# Altium project USBtoUARTbreakout.PrjPcb
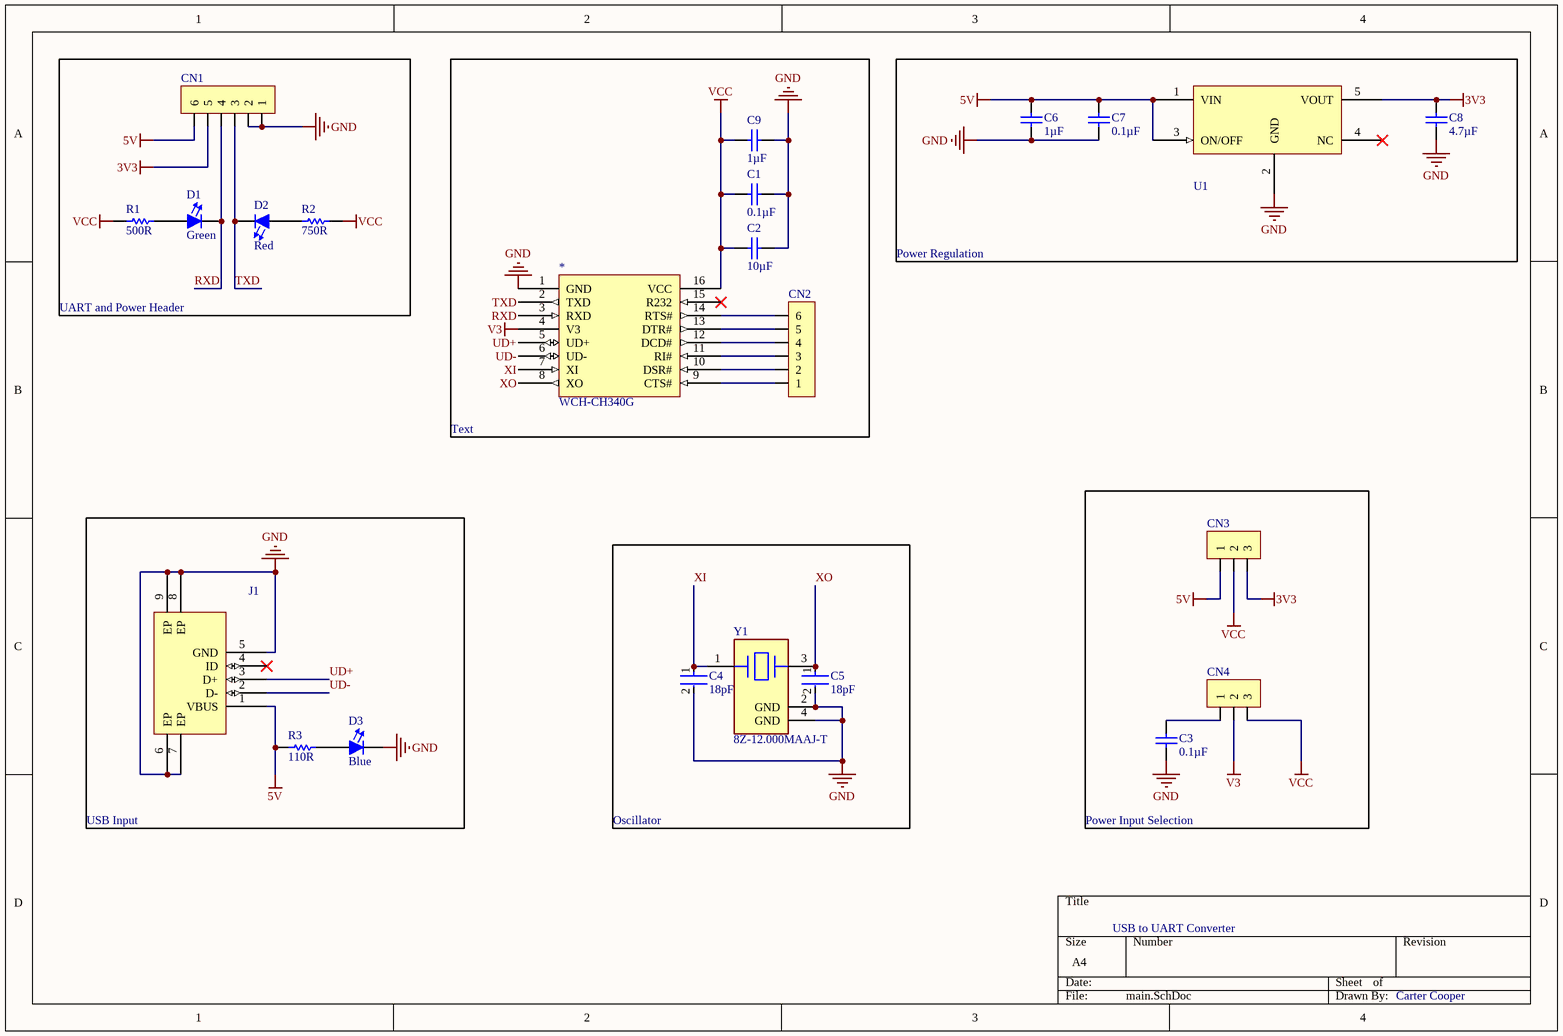
[diagram p0: main.SchDoc]
1 sheet, 23 parts. Net scope: global (net labels, ports and power ports of the same name join across sheets).
Board file: USBtoUARTboard.PcbDoc

## Sheet main.SchDoc
size A4

### Parts
*  WCH-CH340G  [SOP127P600X175-16N]
C1  value 0.1µF  [CAPC1608N(0603")]  (hidden comment: 0.1uF 16V 0603 SMD, Ceramic)
C2  value 10µF  [CAPC1608N(0603")]  (hidden comment: 0.1uF 16V 0603 SMD, Ceramic)
C3  value 0.1µF  [CAPC1608N(0603")]  (hidden comment: 0.1uF 16V 0603 SMD, Ceramic)
C4  Capacitance: 18pF  [FP-CGA3E-0_3-0_1-MFG]  (hidden comment: CGA3E2C0G1H180J080AA)
C5  Capacitance: 18pF  [FP-CGA3E-0_3-0_1-MFG]  (hidden comment: CGA3E2C0G1H180J080AA)
C6  value 1µF  [CAPC1608N(0603")]  (hidden comment: 1uF 50V 0603 SMD, Ceramic)
C7  value 0.1µF  [CAPC1608N(0603")]  (hidden comment: 0.1uF 16V 0603 SMD, Ceramic)
C8  value 4.7µF  [CAPC1608N(0603")]  (hidden comment: 4.7uF 10V 0603 SMD, Ceramic)
C9  value 1µF  [CAPC1608N(0603")]  (hidden comment: 1uF 50V 0603 SMD, Ceramic)
CN1  Header, Male, 1x6  [Header, Male, 1X6]  (value not drawn)
CN2  Header, Male, 1x6  [Header, Male, 1X6]  (value not drawn)
CN3  Header, Male, 1x3, Pitch: 0.1" (2.54mm), THT  [Header, Male, 1x3, Pitch: 0.1" (2.54mm),THT]  (value not drawn)
CN4  Header, Male, 1x3, Pitch: 0.1" (2.54mm), THT  [Header, Male, 1x3, Pitch: 0.1" (2.54mm),THT]  (value not drawn)
D1  Color: Green  [FP-LB_Q39E-MFG]  (hidden comment: LT Q39G-Q1OO-25-1)
D2  Color: Red  [FP-LB_Q39E-MFG]  (hidden comment: LSQ976-NR-1)
D3  Color: Blue  [FP-LB_Q39E-MFG]  (hidden comment: LBQ39E-N1OO-35-1)
J1  USB - Micro B Female SMD  [Edge Connector]  (value not drawn)
R1  Resistance: 500R  [RESC0603(1608)_N]  (hidden comment: RC0603FR-07750RL)
R2  Resistance: 750R  [RESC0603(1608)_N]  (hidden comment: RC0603FR-07750RL)
R3  Resistance: 110R  [RESC1608X55X25ML10T15]  (hidden comment: RC0603FR-07110RL)
U1  LP2981-33DBVR  [SOT95P280X145-5N]  (value not drawn)
Y1  8Z-12.000MAAJ-T  [FP-8Z-MFG]

### Blocks framed on the sheet
UART and Power Header: CN1 D1 D2 R1 R2
Text: * C1 C2 C9 CN2
Power Regulation: C6-C8 U1
USB Input: D3 J1 R3
Power Input Selection: C3 CN3 CN4
Oscillator: C4 C5 Y1

### Nets
3V3: C8.2(Cathode) CN1.5 CN3.3 U1.5(VOUT)
5V: C6.2(Cathode) C7.2(Cathode) CN1.6 CN3.1 J1.1(VBUS) R3.2 U1.1(VIN) U1.3(ON/OFF)
GND: *.1(GND) C1.2(Cathode) C2.2(Cathode) C3.1(Anode) C4.2 C5.2 C6.1(Anode) C7.1(Anode) C8.1(Anode) C9.2(Cathode) CN1.1 CN1.2 D3.1(Cathode) J1.5(GND) J1.6(EP) J1.7(EP) J1.8(EP) J1.9(EP) U1.2(GND) Y1.2(GND) Y1.4(GND)
V3: *.4(V3) CN4.2
VCC: *.16(VCC) C1.1(Anode) C2.1(Anode) C9.1(Anode) CN3.2 CN4.3 R1.1 R2.2
RXD: *.3(RXD) CN1.4 D1.1(Cathode)
TXD: *.2(TXD) CN1.3 D2.1(Cathode)
UD+: *.5(UD+) J1.3(D+)
UD-: *.6(UD-) J1.2(D-)
XI: *.7(XI) C4.1 Y1.1
XO: *.8(XO) C5.1 Y1.3
Net*_9: *.9(CTS#) CN2.1
Net*_10: *.10(DSR#) CN2.2
Net*_11: *.11(RI#) CN2.3
Net*_12: *.12(DCD#) CN2.4
Net*_13: *.13(DTR#) CN2.5
Net*_14: *.14(RTS#) CN2.6
NetC3_2: C3.2(Cathode) CN4.1
NetD1_2: D1.2(Anode) R1.2
NetD2_2: D2.2(Anode) R2.1
NetD3_2: D3.2(Anode) R3.1

Not connected (* = marked no-connect by the designer): * 15(R232)*; J1 4(ID)*; U1 4(NC)*

### Notes on the sheet
- USB to UART Converter
- Carter Cooper

### Library data of the parts
* = CMP-031-0001-1: USB to UART Transceiver. USB 2.0 2Mbps. LCSC #C14267; LCSC Part Number: C14267
C1-C3 C7 = CMP-006-0005-1: Capacitor, Ceramic, 16V, +/- 10%, 0603 SMD, X7R; Created By: Andy Bates; Published: 16-04-26; PackageDescription: Chip Capacitor; Pin Count: 2; Source: AUVic_Schematic_Library_Capacitors.SchLib; Design Item ID: 0.1uF 16V 0603 SMD, Ceramic; Component Type: Standard; Publisher: AUVic
C4 C5 = CMP-00115-1: CAP CER 18PF 50V C0G 0603; DK #: 445-5631-1-ND; Tolerance: 5%; Weight: 7.1E-05oz; Lead Free: Lead Free; Depth: 0.8mm; Width: 0.031inch; Mount: Surface Mount; Voltage Rating (DC): 50V; REACH SVHC: No SVHC; Height: 0.8mm; Case/Package: 0603; Resistor Type: Ceramic; Radiation Hardening: No; Case Code (Imperial): 0603; Thickness: 0.035inch; Max Operating Temperature: 125°C; Dielectric: C0G; Min Operating Temperature: -55°C; Voltage Rating: 50V; Packaging: Tape and Reel; Length: 1.6mm; Termination: SMD/SMT; Case Code (Metric): 1608; Package Quantity: 1; Ratings: AEC-Q200
C6 C9 = CMP-006-0028-1: Capacitor, Ceramic, 50V, +/- 10%, 0603 SMD, X5R; Design Item ID: 1uF 50V 0603 SMD, Ceramic; Created By: Lyden Smith; PackageDescription: Chip Capacitor; Source: AUVic_Schematic_Library_Capacitors.SchLib; Date Created: 2017-10-26; Pin Count: 2; Component Type: Standard
C8 = CMP-006-0043-1: Capacitor, Ceramic, 10V, +/- 10%, 0603 SMD, X5R; MFG: Samsung; MFG#: GRM188R61A475KE15D; PackageDescription: Chip Capacitor; Source: AUVic_Schematic_Library_Capacitors.SchLib; Published: 16-06-23; Created By: Ashwin Sira; Component Type: Standard; Pin Count: 2; Publisher: AUVic; Design Item ID: 4.7uF 10V 0603 SMD, Ceramic
CN1 CN2 = CMP-005-0031-1: 1x6, Pads Pitch: 0.1" (2.54mm), Through hole; Made Bates: Andy Bates; Pin Count: 6; Component Type: Standard; Design Item ID: Header, Male, 1x6; Source: AUVic_Schematic_Library_Connectors.SchLib; Supplier 1 Part Number: 952-2270-ND
CN3 CN4 = CMP-005-0025-1: Created By: Ashwin Sira; Pin Count: 3; Component Type: Standard; Design Item ID: Header, Male, 1x3, Pitch: 0.1" (2.54mm), THT; Reviewed By: *; Last Updated: *; Source: AUVic_Schematic_Library_Connectors.SchLib; Publisher: AUVic; Date Published: 2016-03-03
D1 = CMP-00064-3: LED GREEN DIFFUSED 0603 SMD; Dominant Wavelength: 530nm; Luminous Intensity: 280mcd; Lens Style: Diffused,Colorless,Rectangular; Number of LEDs: 1; Forward Voltage: 2.85V; Test Current: 5mA; Reverse Voltage: 5V; Forward Current: 15mA; Luminous Flux: 0.55lm; Radiation Hardening: No; Packaging: Tape and Reel; Mount: Surface Mount; Max Operating Temperature: 85°C; Number of Elements: 1; Number of Pins: 2; Min Operating Temperature: -40°C; Depth: 0.9mm; Case/Package: SMD/SMT; Length: 1.7mm
D2 = CMP-00066-2: LED Red 645nm 2-Pin Chip 0603(1608Metric) T/R; Lens Transparency: Diffused; Power Dissipation: 65mW; Forward Voltage: 2.5V; Dominant Wavelength: 633nm; Number of Elements: 1; Lens Style: Diffused,Flat,Colorless,Rectangular; Lens Color: White; Viewing Angle: 160°; Luminous Flux: 0.33lm; Test Current: 20mA; Forward Current: 25mA; Luminous Intensity: 180mcd; Reverse Voltage: 12V; Lens Size: 0.8mm; Max Operating Temperature: 85°C; Depth: 0.9mm; Illumination Color: Red; Packaging: Tape and Reel; Min Operating Temperature: -30°C; Case Code (Imperial): 0603; Case Code (Metric): 1608; Number of Pins: 2; Mount: Surface Mount; Height: 0.8mm; Package Quantity: 1; Length: 1.7mm; Width: 0.8mm; Number of LEDs: 1; Case/Package: 0603; Radiation Hardening: No
D3 = CMP-00063-3: LED BLUE DIFFUSED 0603 SMD; Luminous Flux: 0.13lm; Lens Size: 0.8mm; Lens Color: White; Viewing Angle: 130°; Luminous Intensity: 42mcd; Number of LEDs: 1; Dominant Wavelength: 470nm; Lens Style: Flat,Diffused,Colorless,Rectangular; Test Current: 5mA; Forward Voltage: 2.85V; Packaging: Tape and Reel; Case/Package: 0603; Height: 0.4mm; Number of Pins: 2; Mount: Surface Mount; Case Code (Metric): 1608; Case Code (Imperial): 0603; Lens Transparency: Diffused; Width: 0.8mm; Length: 1.6mm; Radiation Hardening: No
J1 = CMP-00108-2: USB - Micro B Female USB 2 5 SMD USB Connectors; Created by: Miguel Manguerra; LCSC Part Number: C319170
R1 R2 = CMP-00070-1: Res Thick Film 0603 750 Ohm 1% 0.1W(1/10W) ±100ppm/C Epoxy SMD T/R; Voltage Rating (DC): 50V; Power Rating: 100mW; Temperature Coefficient: 100ppm/°C; Height: 0.022inch; Tolerance: 1%; Voltage Rating: 50V; Case Code (Metric): 1608; Packaging: Tape and Reel; Depth: 0.8mm; Package Quantity: 1; Termination: SMD/SMT; Number of Terminations: 2; Min Operating Temperature: -55°C; Case/Package: 0603; Composition: Thick Film; Width: 0.031inch; Max Operating Temperature: 155°C; Max Power Dissipation: 100mW; Length: 1.6mm; Military Standard: Not; Features: Moisture Resistant; Case Code (Imperial): 0603; Lead Free: Lead Free
R3 = CMP-00069-1: RES SMD 110 OHM 1% 1/10W 0603; Max Power Dissipation: 100mW; Voltage Rating (DC): 50V; Temperature Coefficient: 100ppm/°C; Working Voltage: 75V; Military Standard: Not; Termination: SMD/SMT; Number of Terminations: 2; Features: Moisture Resistant; Min Operating Temperature: -55°C; Power Rating: 100mW; Height: 0.022inch; Package Quantity: 1; Lead Free: Lead Free; Tolerance: 1%; Voltage Rating: 50V; Composition: Thick Film; Case Code (Imperial): 0603; Length: 1.6mm; Packaging: Tape and Reel; Case Code (Metric): 1608; Max Operating Temperature: 155°C; Depth: 0.8mm; Case/Package: 0603; Width: 0.031inch
U1 = CMP-044-0003-2: IC REG LINEAR 3.3V 100MA SOT23-5; Max Input Voltage: 16V; Min Input Voltage: 2.2V; Number of Regulators: 1; Output Voltage Accuracy: 2%; Polarity: Positive; Input Bias Current: 600uA; Output Type: Fixed; Dropout Voltage: 200mV; Package Quantity: 1; REACH SVHC: No SVHC; Output Voltage: 3.3V; Min Operating Temperature: -40°C; Case/Package: SOT-23; Max Output Current: 100mA; Lead Free: Lead Free; Max Operating Temperature: 125°C; Number of Outputs: 1; Number of Pins: 5; Mount: Surface Mount; Accuracy: 2%; Nominal Output Voltage: 3.3V; Output Current: 100mA; Packaging: Tape and Reel; Quiescent Current: 600uA; Radiation Hardening: No; Contact Plating: Tin,Matte
Y1 = CMP-18717-000009-1: CRYSTAL 12.0000MHZ 18PF SMD; ESR (Equivalent Series Resistance): 150R; Frequency Tolerance: 30ppm; Frequency: 12MHz; Number of Pins: 4; Width: 0.079inch; Termination: SMD/SMT; Packaging: Tape and Reel; Height: 0.022inch; Load Capacitance: 18pF; Max Operating Temperature: 70°C; REACH SVHC: No SVHC; Tolerance: 30ppm; Length: 2.5mm; Depth: 2mm; Package Quantity: 1; Case/Package: SMD/SMT; Mount: Surface Mount; Frequency Stability: 30ppm; Min Operating Temperature: -20°C